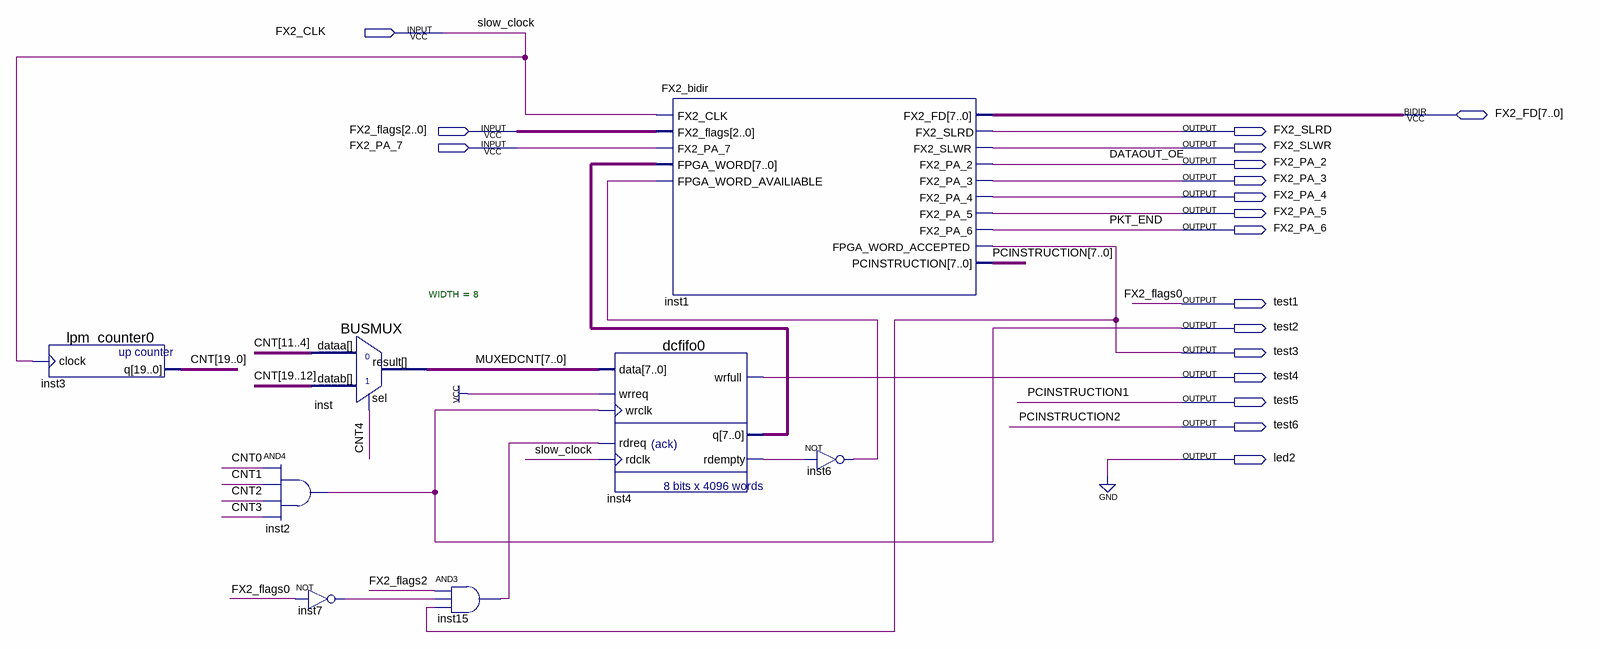
[diagram p0: schematic sheet]
// Quartus schematic testingigo-done-121506.bdf as structural Verilog: 8 symbols, 18 pins
module \testingigo-done-121506  (
  input  FX2_CLK,
  input  [2:0] FX2_flags,
  input  FX2_PA_7,
  inout  [7:0] FX2_FD,
  output FX2_SLRD,
  output FX2_SLWR,
  output FX2_PA_2,
  output FX2_PA_3,
  output FX2_PA_4,
  output FX2_PA_5,
  output FX2_PA_6,
  output test1,
  output test2,
  output test3,
  output test4,
  output test5,
  output test6,
  output led2
);

  wire inst4_rdempty, inst6_out, inst7_out, inst15_out;
  wire [7:0] inst4_q, MUXEDCNT, PCINSTRUCTION;
  wire [19:0] CNT;

  lpm_counter0 inst3 (.clock(FX2_CLK), .q(CNT));
  and inst2 (test2, CNT[0], CNT[1], CNT[2], CNT[3]);
  BUSMUX #(.WIDTH(8)) inst (.datab(CNT[19:12]), .sel(CNT[4]), .dataa(CNT[11:4]), .result(MUXEDCNT));
  not inst7 (inst7_out, FX2_flags[0]);
  and inst15 (inst15_out, FX2_flags[2], inst7_out, test3);
  FX2_bidir inst1 (
    .FX2_CLK(FX2_CLK), .FX2_flags(FX2_flags), .FX2_PA_7(FX2_PA_7), .FPGA_WORD(inst4_q),
    .FPGA_WORD_AVAILIABLE(inst6_out), .FX2_SLRD(FX2_SLRD), .FX2_SLWR(FX2_SLWR), .FX2_PA_2(FX2_PA_2),
    .FX2_PA_3(FX2_PA_3), .FX2_PA_4(FX2_PA_4), .FX2_PA_5(FX2_PA_5), .FX2_PA_6(FX2_PA_6),
    .FPGA_WORD_ACCEPTED(test3), .PCINSTRUCTION({PCINSTRUCTION[7:3], test6, test5, PCINSTRUCTION[0]}),
    .FX2_FD(FX2_FD));
  dcfifo0 inst4 (
    .data(MUXEDCNT), .wrreq(1'b1), .wrclk(test2), .rdreq(inst15_out), .rdclk(FX2_CLK), .wrfull(test4),
    .q(inst4_q), .rdempty(inst4_rdempty));
  not inst6 (inst6_out, inst4_rdempty);

  assign led2 = 1'b0;
  assign test1 = FX2_flags[0];

  // Other names for the same wires on the sheet: DATAOUT_OE = FX2_PA_2; PCINSTRUCTION[2:1] = {test6, test5};
  //   PCINSTRUCTION1 = test5; PCINSTRUCTION2 = test6; PKT_END = FX2_PA_6; slow_clock = FX2_CLK
endmodule
